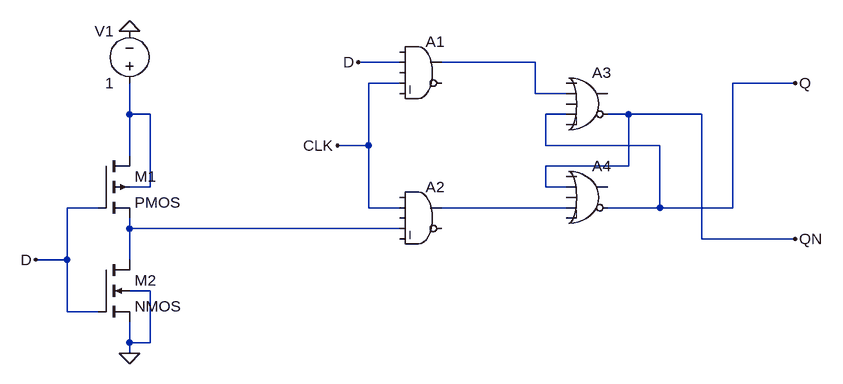
[diagram p0: schematic D_LATCH.asc]
D_LATCH.asc, the LTspice schematic file:
Version 4
SHEET 1 880 680
WIRE 16 -16 -48 -16
WIRE 224 -16 80 -16
WIRE 16 16 -32 16
WIRE 624 16 528 16
WIRE 224 32 224 -16
WIRE 272 32 224 32
WIRE -400 64 -400 16
WIRE -368 64 -400 64
WIRE 272 64 240 64
WIRE 368 64 336 64
WIRE 480 64 368 64
WIRE -32 112 -32 16
WIRE -32 112 -80 112
WIRE 240 112 240 64
WIRE 416 112 240 112
WIRE -400 128 -400 64
WIRE 368 144 368 64
WIRE 368 144 240 144
WIRE -368 176 -368 64
WIRE -368 176 -400 176
WIRE 240 176 240 144
WIRE 272 176 240 176
WIRE -448 208 -496 208
WIRE -32 208 -32 112
WIRE 16 208 -32 208
WIRE 272 208 80 208
WIRE 416 208 416 112
WIRE 416 208 336 208
WIRE 528 208 528 16
WIRE 528 208 416 208
WIRE -400 240 -400 224
WIRE 16 240 -400 240
WIRE 480 256 480 64
WIRE 624 256 480 256
WIRE -496 288 -496 208
WIRE -496 288 -544 288
WIRE -400 288 -400 240
WIRE -368 336 -400 336
WIRE -496 368 -496 288
WIRE -448 368 -496 368
WIRE -400 416 -400 384
WIRE -368 416 -368 336
WIRE -368 416 -400 416
WIRE -400 432 -400 416
FLAG -80 112 CLK
FLAG -48 -16 D
FLAG 624 256 QN
FLAG 624 16 Q
FLAG -400 -64 0
FLAG -400 432 0
FLAG -544 288 D
SYMBOL Digital\\and 48 -64 R0
SYMATTR InstName A1
SYMBOL Digital\\and 48 160 R0
SYMATTR InstName A2
SYMBOL Digital\\or 304 -16 R0
SYMATTR InstName A3
SYMBOL Digital\\or 304 128 R0
SYMATTR InstName A4
SYMBOL pmos4 -448 128 R0
SYMATTR InstName M1
SYMBOL nmos4 -448 288 R0
SYMATTR InstName M2
SYMBOL voltage -400 32 R180
WINDOW 0 24 96 Left 2
WINDOW 3 24 16 Left 2
WINDOW 123 0 0 Left 0
WINDOW 39 0 0 Left 0
SYMATTR InstName V1
SYMATTR Value 1

The netlist it stands for:
* D_LATCH.asc
A1 0 D 0 CLK 0 0 N001 0 AND
A2 0 CLK 0 N004 0 0 N003 0 AND
A3 0 N001 0 Q 0 QN 0 0 OR
A4 0 QN 0 N003 0 Q 0 0 OR
M1 N002 D N004 N002 PMOS
M2 N004 D 0 0 NMOS
V1 N002 0 1
.model NMOS NMOS
.model PMOS PMOS
.lib standard.mos
.backanno
.end